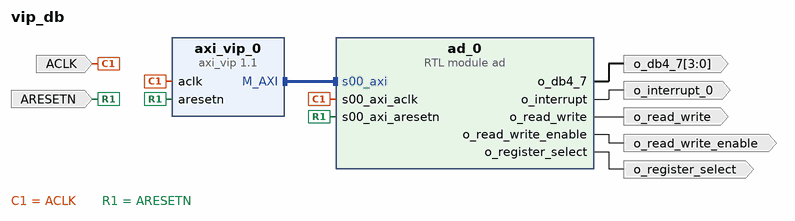
[diagram p0: block diagram of the top level]
# Vivado block design vip_db, xc7a100tcsg324-1, Vivado 2023.2
create_bd_design vip_db

create_bd_port -dir O -type intr o_interrupt_0
create_bd_port -dir O -from 3 -to 0 o_db4_7
create_bd_port -dir O o_register_select
create_bd_port -dir O o_read_write
create_bd_port -dir O o_read_write_enable
create_bd_port -dir I -type clk ACLK
set_property -dict {CONFIG.FREQ_HZ 100000000} [get_bd_ports ACLK]
create_bd_port -dir I -type rst ARESETN

create_bd_cell -type ip -vlnv xilinx.com:ip:axi_vip:1.1 axi_vip_0
set_property -dict [list \
  CONFIG.ADDR_WIDTH 32 \
  CONFIG.DATA_WIDTH 32 \
  CONFIG.HAS_BRESP 1 \
  CONFIG.HAS_PROT 1 \
  CONFIG.HAS_RRESP 1 \
  CONFIG.HAS_WSTRB 1 \
  CONFIG.INTERFACE_MODE MASTER \
  CONFIG.PROTOCOL AXI4LITE \
  CONFIG.READ_WRITE_MODE READ_WRITE \
] [get_bd_cells axi_vip_0]
create_bd_cell -type module -reference ad ad_0
set_property -dict {CONFIG.G_AXI_AD_T_16_4MS 164 CONFIG.G_AXI_AD_T_40_US 80 CONFIG.G_AXI_AD_T_POWER_ON 300} [get_bd_cells ad_0]

# ---- connections ----

connect_bd_intf_net [get_bd_intf_pins axi_vip_0/M_AXI] [get_bd_intf_pins ad_0/s00_axi]
connect_bd_net [get_bd_ports ACLK] [get_bd_pins axi_vip_0/aclk] [get_bd_pins ad_0/s00_axi_aclk]
connect_bd_net [get_bd_ports ARESETN] [get_bd_pins axi_vip_0/aresetn] [get_bd_pins ad_0/s00_axi_aresetn]
connect_bd_net [get_bd_pins ad_0/o_db4_7] [get_bd_ports o_db4_7]
connect_bd_net [get_bd_pins ad_0/o_interrupt] [get_bd_ports o_interrupt_0]
connect_bd_net [get_bd_pins ad_0/o_read_write] [get_bd_ports o_read_write]
connect_bd_net [get_bd_pins ad_0/o_read_write_enable] [get_bd_ports o_read_write_enable]
connect_bd_net [get_bd_pins ad_0/o_register_select] [get_bd_ports o_register_select]

# ---- address map ----
assign_bd_address -offset 0x00000000 -range 4K -target_address_space [get_bd_addr_spaces axi_vip_0/Master_AXI] [get_bd_addr_segs ad_0/s00_axi/reg0]

validate_bd_design
save_bd_design
